# Altium schematic sheet Sheet1.SchDoc
size A3
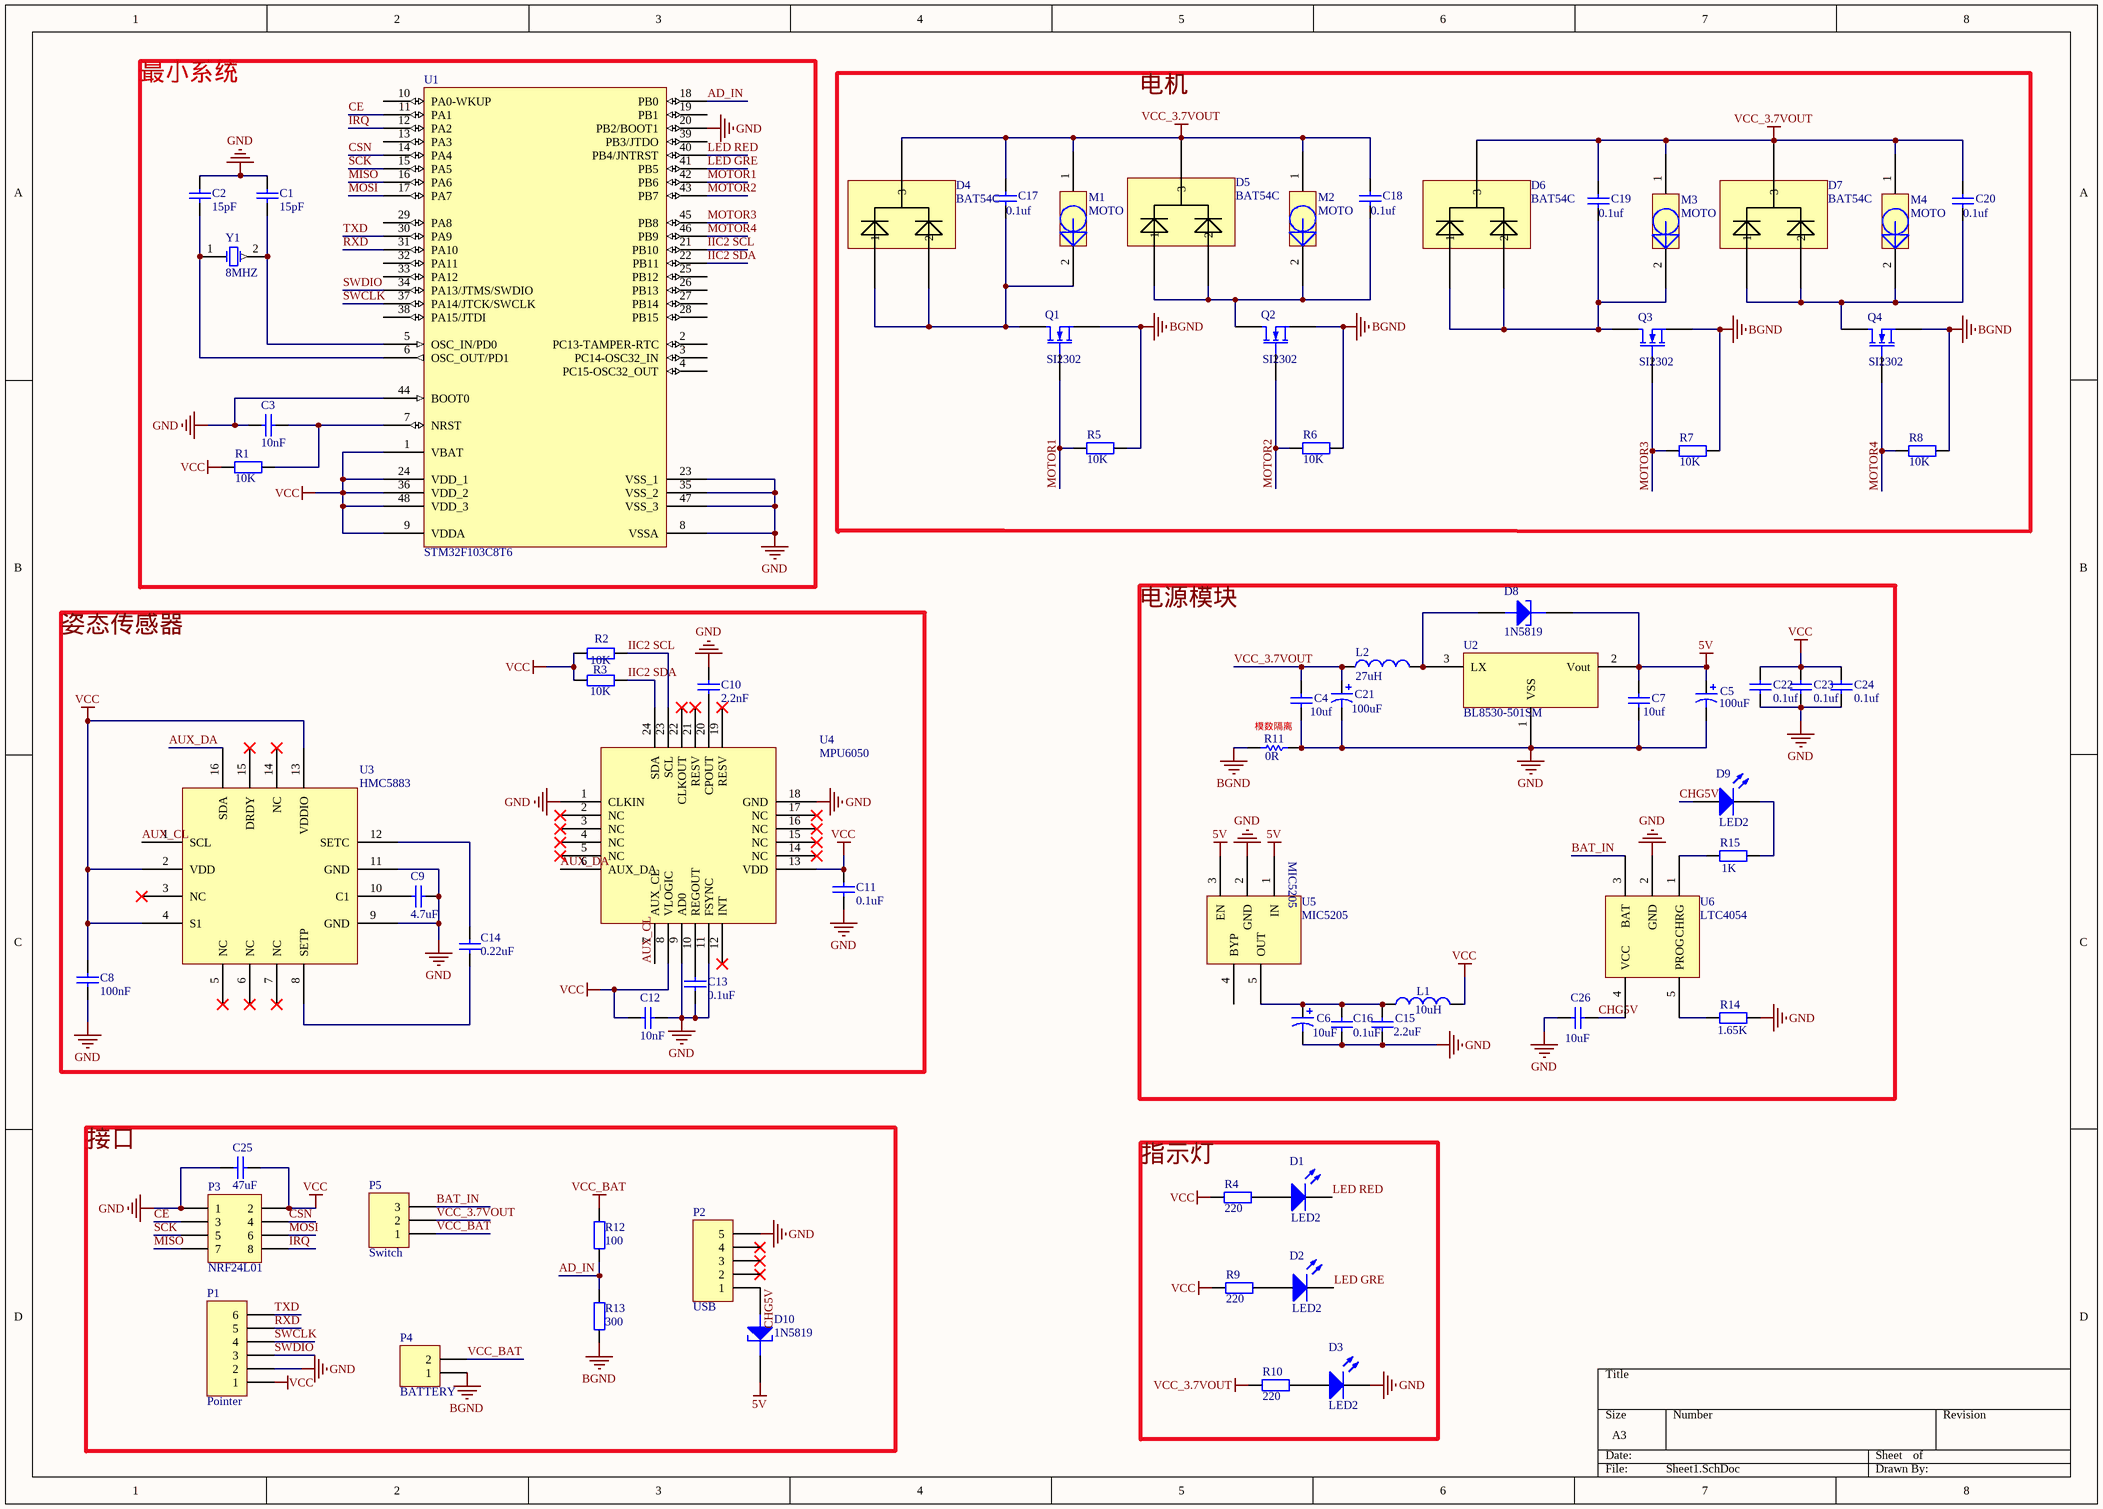
[diagram p0: Sheet1.SchDoc]

## Parts
C1  value 15pF  [0603-N-CAP]  (hidden comment: Cap Semi)
C2  value 15pF  [0603-N-CAP]  (hidden comment: Cap Semi)
C3  value 10nF  [0603-N-CAP]  (hidden comment: Cap Semi)
C4  value 10uf  [0603-N-CAP]  (hidden comment: Cap)
C5  value 100uF  [1210]  (hidden comment: Cap Pol3)
C6  value 10uF  [3216]  (hidden comment: Cap Pol3)
C7  value 10uf  [0603-N-CAP]  (hidden comment: Cap)
C8  value 100nF  [0603-N-CAP]  (hidden comment: Cap Semi)
C9  value 4.7uF  [0603-N-CAP]  (hidden comment: Cap Semi)
C10  value 2.2nF  [0603-N-CAP]  (hidden comment: Cap Semi)
C11  value 0.1uF  [0603-N-CAP]  (hidden comment: Cap Semi)
C12  value 10nF  [0603-N-CAP]  (hidden comment: Cap Semi)
C13  value 0.1uF  [0603-N-CAP]  (hidden comment: Cap Semi)
C14  value 0.22uF  [0603-N-CAP]  (hidden comment: Cap Semi)
C15  value 2.2uF  [0603-N-CAP]  (hidden comment: Cap)
C16  value 0.1uF  [0603-N-CAP]  (hidden comment: Cap)
C17  value 0.1uf  [0603-N-CAP]  (hidden comment: Cap)
C18  value 0.1uf  [0603-N-CAP]  (hidden comment: Cap)
C19  value 0.1uf  [0603-N-CAP]  (hidden comment: Cap)
C20  value 0.1uf  [0603-N-CAP]  (hidden comment: Cap)
C21  value 100uF  [1210]  (hidden comment: Cap Pol3)
C22  value 0.1uf  [0603-N-CAP]  (hidden comment: Cap)
C23  value 0.1uf  [0603-N-CAP]  (hidden comment: Cap)
C24  value 0.1uf  [0603-N-CAP]  (hidden comment: Cap)
C25  value 47uF  [1206]  (hidden comment: Cap Semi)
C26  value 10uF  [0603-N-CAP]  (hidden comment: Cap)
D1  LED2  [6-0805_N]
D2  LED2  [6-0805_N]
D3  LED2  [6-0805_N]
D4  BAT54C  [SOT-23]
D5  BAT54C  [SOT-23]
D6  BAT54C  [SOT-23]
D7  BAT54C  [SOT-23]
D8  1N5819  [1206]
D9  LED2  [6-0805_N]
D10  1N5819  [1206]
L1  value 10uH  [0603-N-res]  (hidden comment: Inductor)
L2  value 27uH  [0603-N-res]  (hidden comment: Inductor)
M1  MOTO  [HDR1X2]
M2  MOTO  [HDR1X2]
M3  MOTO  [HDR1X2]
M4  MOTO  [HDR1X2]
P1  Pointer  [HDR1X6]
P2  USB  [Micro Usb]
P3  NRF24L01  [head 4X2]
P4  BATTERY  [HDR1X2]
P5  Switch  [HDR1X3]
Q1  SI2302  [SOT-23]
Q2  SI2302  [SOT-23]
Q3  SI2302  [SOT-23]
Q4  SI2302  [SOT-23]
R1  value 10K  [0603-N-res]  (hidden comment: Res2)
R2  value 10K  [0603-N-res]  (hidden comment: Res2)
R3  value 10K  [0603-N-res]  (hidden comment: Res2)
R4  value 220  [0603-N-res]  (hidden comment: Res2)
R5  value 10K  [0603-N-res]  (hidden comment: Res2)
R6  value 10K  [0603-N-res]  (hidden comment: Res2)
R7  value 10K  [0603-N-res]  (hidden comment: Res2)
R8  value 10K  [0603-N-res]  (hidden comment: Res2)
R9  value 220  [0603-N-res]  (hidden comment: Res2)
R10  value 220  [0603-N-res]  (hidden comment: Res2)
R11  value 0R  [0603-N-res]  (hidden comment: Res1)
R12  value 100  [0603-N-res]  (hidden comment: Res2)
R13  value 300  [0603-N-res]  (hidden comment: Res2)
R14  value 1.65K  [0603-N-res]  (hidden comment: Res2)
R15  value 1K  [0603-N-res]  (hidden comment: Res2)
U1  STM32F103C8T6  [LQFP48_N]
U2  BL8530-501SM  [SOT223]
U3  HMC5883  [HMC5883L]
U4  MPU6050  [MPU 6050]
U5  MIC5205  [MIC5205]
U6  LTC4054  [MIC5205]
Y1  8MHZ  [XTAL1]

## Blocks framed on the sheet
最小系统: C1-C3 R1 U1 Y1
电机: C17-C20 D4-D7 M1-M4 Q1-Q4 R5-R8
电源模块: C4-C7 C15 C16 C21-C24 C26 D8 D9 L1 L2 R11 R14 R15 U2 U5 U6
姿态传感器: C8-C14 R2 R3 U3 U4
接口: C25 D10 P1-P5 R12 R13
指示灯: D1-D3 R4 R9 R10

## Nets
5V: C5.1 C7.2 D8.2(K) D10.2(K) U2.2(Vout) U5.1(IN) U5.3(EN)
BGND: P4.1 Q1.3(S) Q2.3(S) Q3.3(S) Q4.3(S) R5.1 R6.1 R7.1 R8.1 R11.1 R13.1
GND: C1.1 C2.2 C3.1 C4.1 C5.2 C6.2 C7.1 C8.1 C9.1 C10.2 C11.1 C12.2 C13.1 C15.1 C16.1 C21.2 C22.1 C23.1 C24.1 C25.1 C26.1 D3.2(K) P1.2 P2.5 P3.1 R11.2 R14.2 U1.8(VSSA) U1.20(PB2/BOOT1) U1.23(VSS_1) U1.35(VSS_2) U1.44(BOOT0) U1.47(VSS_3) U2.1(VSS) U3.9(GND) U3.11(GND) U4.1(CLKIN) U4.9(AD0) U4.11(FSYNC) U4.18(GND) U5.2(GND) U6.2(GND)
VCC: C8.2 C11.2 C12.1 C22.2 C23.2 C24.2 C25.2 L1.2 P1.1 P3.2 R1.2 R2.2 R3.2 R4.2 R9.2 U1.1(VBAT) U1.9(VDDA) U1.24(VDD_1) U1.36(VDD_2) U1.48(VDD_3) U3.2(VDD) U3.4(S1) U3.13(VDDIO) U4.8(VLOGIC) U4.13(VDD)
VCC_3.7VOUT: C4.2 C17.2 C18.2 C19.2 C20.2 C21.1 D4.3 D5.3 D6.3 D7.3 L2.1 M1.1 M2.1 M3.1 M4.1 P5.2 R10.2
VCC_BAT: P4.2 P5.1 R12.2
AD_IN: R12.1 R13.2 U1.18(PB0)
AUX_CL: U3.1(SCL) U4.7(AUX_CL)
AUX_DA: U3.16(SDA) U4.6(AUX_DA)
BAT_IN: P5.3 U6.3(BAT)
CE: P3.3 U1.11(PA1)
CHG5V: C26.2 D9.1(A) D10.1(A) P2.1 U6.4(VCC)
CSN: P3.4 U1.14(PA4)
IIC2 SCL: R2.1 U1.21(PB10) U4.23(SCL)
IIC2 SDA: R3.1 U1.22(PB11) U4.24(SDA)
IRQ: P3.8 U1.12(PA2)
LED GRE: D2.2(K) U1.41(PB5)
LED RED: D1.2(K) U1.40(PB4/JNTRST)
MISO: P3.7 U1.16(PA6)
MOSI: P3.6 U1.17(PA7)
MOTOR1: Q1.2(G) R5.2 U1.42(PB6)
MOTOR2: Q2.2(G) R6.2 U1.43(PB7)
MOTOR3: Q3.2(G) R7.2 U1.45(PB8)
MOTOR4: Q4.2(G) R8.2 U1.46(PB9)
RXD: P1.5 U1.31(PA10)
SCK: P3.5 U1.15(PA5)
SWCLK: P1.4 U1.37(PA14/JTCK/SWCLK)
SWDIO: P1.3 U1.34(PA13/JTMS/SWDIO)
TXD: P1.6 U1.30(PA9)
NetC1_2: C1.2 U1.5(OSC_IN/PD0) Y1.2(OSC2)
NetC2_1: C2.1 U1.6(OSC_OUT/PD1) Y1.1(OSC1)
NetC3_2: C3.2 R1.1 U1.7(NRST)
NetC6_1: C6.1 C15.2 C16.2 L1.1 U5.5(OUT)
NetC9_2: C9.2 U3.10(C1)
NetC10_1: C10.1 U4.20(CPOUT)
NetC13_2: C13.2 U4.10(REGOUT)
NetC14_1: C14.1 U3.12(SETC)
NetC14_2: C14.2 U3.8(SETP)
NetC17_1: C17.1 D4.1 D4.2 M1.2 Q1.1(D)
NetC18_1: C18.1 D5.1 D5.2 M2.2 Q2.1(D)
NetC19_1: C19.1 D6.1 D6.2 M3.2 Q3.1(D)
NetC20_1: C20.1 D7.1 D7.2 M4.2 Q4.1(D)
NetD1_1: D1.1(A) R4.1
NetD2_1: D2.1(A) R9.1
NetD3_1: D3.1(A) R10.1
NetD8_1: D8.1(A) L2.2 U2.3(LX)
NetD9_2: D9.2(K) R15.2
NetR14_1: R14.1 U6.5(PROG)
NetR15_1: R15.1 U6.1(CHRG)

Not connected (* = marked no-connect by the designer): P2 2* 3* 4*; U1 2(PC13-TAMPER-RTC) 3(PC14-OSC32_IN) 4(PC15-OSC32_OUT) 10(PA0-WKUP) 13(PA3) 19(PB1) 25(PB12) 26(PB13) 27(PB14) 28(PB15) 29(PA8) 32(PA11) 33(PA12) 38(PA15/JTDI) 39(PB3/JTDO); U3 3(NC)* 5(NC)* 6(NC)* 7(NC)* 14(NC)* 15(DRDY)*; U4 2(NC)* 3(NC)* 4(NC)* 5(NC)* 12(INT)* 14(NC)* 15(NC)* 16(NC)* 17(NC)* 19(RESV)* 21(RESV)* 22(CLKOUT)*; U5 4(BYP)

## Notes on the sheet
- (near R11) 模数隔离

## Library data of the parts
C1-C3 C8-C14 C25 = Cap Semi: Capacitor (Semiconductor SIM Model); Published: 8-Jun-2000; LatestRevisionDate: 29-May-2009; LatestRevisionNote: IPC-7351 Footprint Added.; PackageReference: C1206; Publisher: Altium Limited; PackageDescription: Chip Capacitor
C4 C7 C15-C20 C22-C24 C26 = Cap: Capacitor; Published: 8-Jun-2000; LatestRevisionDate: 17-Jul-2002; LatestRevisionNote: Re-released for DXP Platform.; PackageReference: RAD-0.3; Publisher: Altium Limited
  C26: PackageDescription: Radial Cap, Thru-Hole; 2 Leads; 0.3 in Pin Spacing
C5 C6 C21 = Cap Pol3: Polarized Capacitor (Surface Mount); Published: 8-Jun-2000; LatestRevisionDate: 29-May-2009; LatestRevisionNote: IPC-7351 Footprint Added.; PackageReference: C0805; Publisher: Altium Limited; PackageDescription: Chip Capacitor
D1-D3 D9 = LED2: Typical RED, GREEN, YELLOW, AMBER GaAs LED; Published: 8-Jun-2000; LatestRevisionDate: 17-Jul-2002; LatestRevisionNote: Re-released for DXP Platform.; PackageVersion: Feb-2002; PackageReference: 3.2X1.6X1.1; Publisher: Altium Limited; PackageDescription: SM LED; 2 Flat Leads
D8 D10 = TUNNEL: Tunnel FDiode
L1 L2 = Inductor: Code_IEC: 1005; Published: 8-Jun-2000; PackageReference: 0402-A; Publisher: Altium Limited; Code_JEITA: 0402
  L1: LatestRevisionDate: 17-Jul-2002; LatestRevisionNote: Re-released for DXP Platform.
  L2: LatestRevisionDate: 29-May-2009; LatestRevisionNote: IPC-7351 Footprint Added.; PackageDescription: Chip Inductor
P1 = Header 6: Header, 6-Pin; LatestRevisionDate: 17-Jul-2002; LatestRevisionNote: Re-released for DXP Platform.; Publisher: Altium Limited
P2 = Header 5: Header, 5-Pin; LatestRevisionDate: 17-Jul-2002; LatestRevisionNote: Re-released for DXP Platform.; Publisher: Altium Limited
P3 = Header 4X2H: Header, 4-Pin, Dual row, Right Angle; LatestRevisionDate: 17-Jul-2002; LatestRevisionNote: Re-released for DXP Platform.; Publisher: Altium Limited
P4 = Header 2: Header, 2-Pin; LatestRevisionDate: 17-Jul-2002; LatestRevisionNote: Re-released for DXP Platform.; Publisher: Altium Limited
P5 = Header 3: Header, 3-Pin; LatestRevisionDate: 17-Jul-2002; LatestRevisionNote: Re-released for DXP Platform.; Publisher: Altium Limited
Q1-Q4 = MOSFET-N: N-Channel MOSFET; pin to pad: 1>3 2>1 3>2; Published: 8-Jun-2000; LatestRevisionDate: 17-Jul-2002; LatestRevisionNote: Re-released for DXP Platform.; PackageVersion: 1995/1996; PackageReference: E3; Publisher: Altium Limited; PackageDescription: TO, Flat Index; 3 In-Line, Axial Leads; Body Dia. 4.6mm; Lead Dia. 0.5 mm (max)
R1-R10 R12-R15 = Res2: Resistor; Published: 8-Jun-2000; LatestRevisionDate: 17-Jul-2002; LatestRevisionNote: Re-released for DXP Platform.; PackageReference: AXIAL-0.4; Publisher: Altium Limited; PackageDescription: Axial Device, Thru-Hole; 2 Leads; 0.4 in Pin Spacing
R11 = Res1: Resistor; Published: 8-Jun-2000; LatestRevisionDate: 17-Jul-2002; LatestRevisionNote: Re-released for DXP Platform.; PackageReference: AXIAL-0.3; Publisher: Altium Limited
U1 = STM32F103C8T6: STM32 ARM-based 32-bit MCU with 64 Kbytes Flash, 48-pin LQFP, Industrial Temperature; Published: 30-May-2008; DatasheetVersion: rev6, Mar-2008; PackageVersion: Mar-2008; PackageReference: LQFP48; Publisher: Altium Limited; PackageDescription: 48-Pin Low-Profile Quad Flat Pack, 7 x 7 mm Body, 0.5 mm Pitch (LQFP48); ComponentLink1Description: Manufacturer Link; ComponentLink1URL: www.st.com/stm32; ComponentLink2Description: Datasheet; ComponentLink2URL: http://www.st.com/stonline/products/literature/ds/13587.pdf
U2 = ME620633
U5 = MIC5205: 5V降压到3.3V
Y1 = XTAL: Crystal Oscillator; Published: 8-Jun-2000; LatestRevisionDate: 17-Jul-2002; LatestRevisionNote: Re-released for DXP Platform.; PackageReference: R38; Publisher: Altium Limited; PackageDescription: Crystal, Thru-Hole; 2 Leads; Body 3.1 x 8.2 mm (Dia.xH)